# Altium project TIDA-010086_mod.PrjPcb (part 3 of 11)
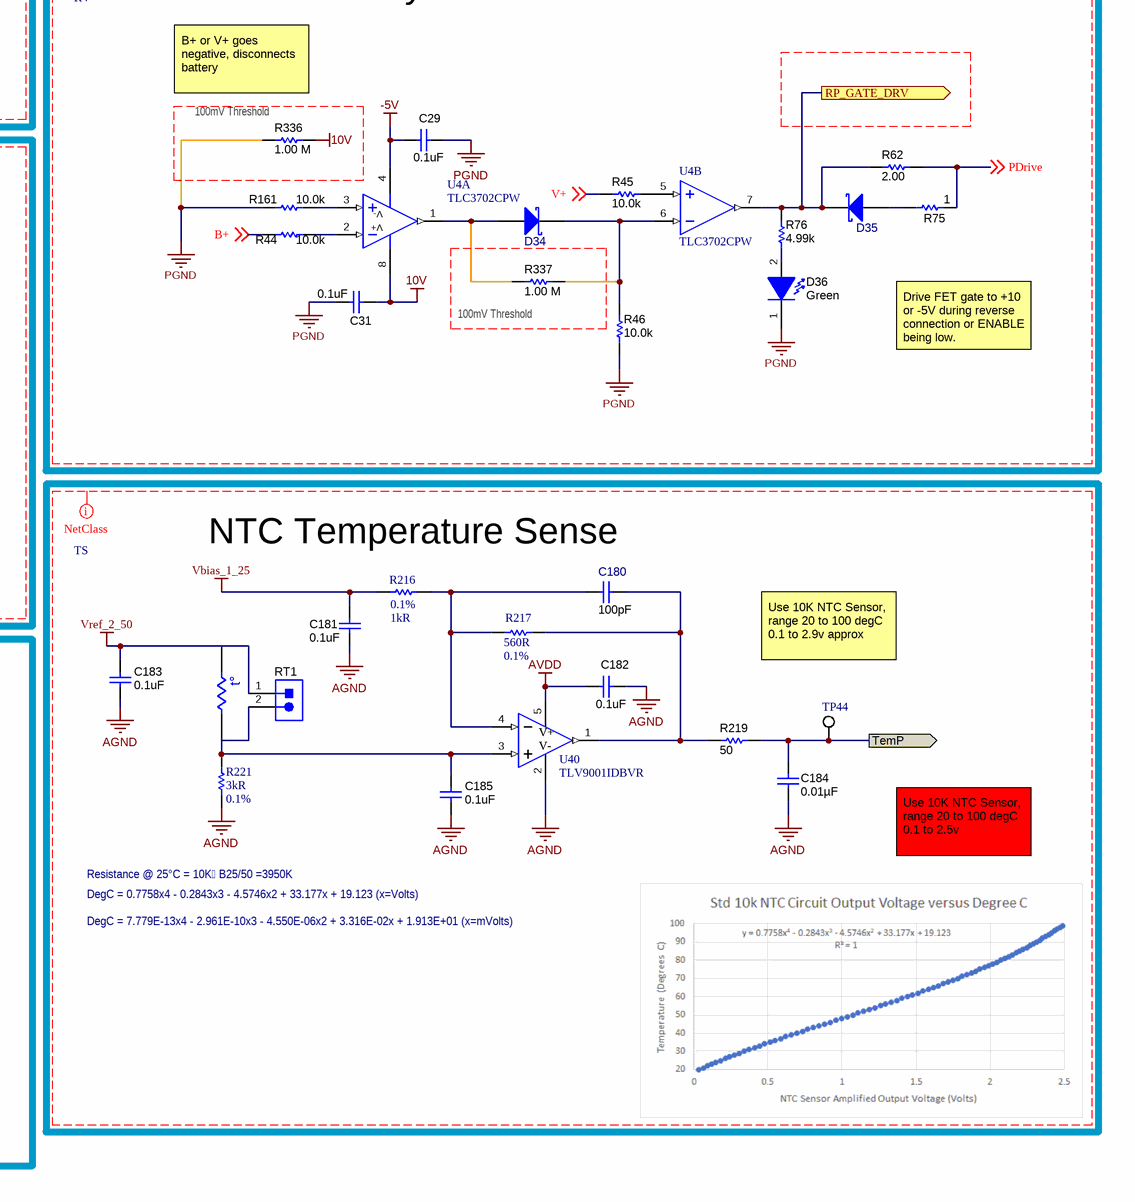
[diagram p20: XTIDA-010086_Power Stage.SchDoc, bottom right]

## Sheet XTIDA-010086_Power Stage.SchDoc: Power Stage (continued)

### Notes on the sheet
- FUSE BROKEN DETECT
- RC snubber
- (near R10) DNP
- RP Disconnect
- (near C16) DNP
- (near R31) 32 0402
- (near R34) SAR ADC Buffer
  OCP and UCP via Comparators
  PeakCurrent Control
  400 kHz 1st order
  Peak, OCP, UCP, Trip
  0.4uS group delay
- 4.02k 0402
- (near C147) 100p 0402
- (near C17) 240p 0603
- (near C33) 11n 0402
- (near C33) 3.32kHz 4th order Bessel CCM CC Control
  samples 33.2kHz
- (near C35) 26.1n 0805
- (near R30) 2k4
- Keep R36 , R40 and C28 near ADS131M08
- 1.74k 0402
- (near C26) 2k 0402
- (near U2) -5V
- (near C27) 10n 0402
- (near C26) 10n 0402
- (near C18) Gain=1+50k/Rg
  =20.8333
  ads131 - FSR=1.2/Gain/5mOhm=11.52A
  c2000 - FSR = 1.25/Gain/5mOhm = 12A
- (near R336) B+ or V+ goes negative, disconnects battery
- (near R336) 100mV Threshold
- 14kHz 4-th Order Filter
  startup CV control
  wide filter, use digital filterings
  sample at 100kHz
- Keep R and C near C2000 Analog Pin
- (near R337) 100mV Threshold
- Drive FET gate to +10 or -5V during reverse connection or ENABLE being low.
- Gain=49.9/100=0.499
  ADC range: 5*0.499=2.495V
- Use 10K NTC Sensor, range 20 to 100 degC 0.1 to 2.9v approx
- 16kHz 4-th Order Filter
  AvgVoltage Control
  VacMeasure
  VdcMeasure
- Keep R68 , R74 and C51 near ADS131M08
- Resistance @ 25°C = 10K B25/50 =3950K
- Use 10K NTC Sensor, range 20 to 100 degC 0.1 to 2.5v
- 10n
- (near U6) -5V
- (near R302) 1.74k
- (near R71) 2k
- DegC = 0.7758x4 - 0.2843x3 - 4.5746x2 + 33.177x + 19.123 (x=Volts)
- DegC = 7.779E-13x4 - 2.961E-10x3 - 4.550E-06x2 + 3.316E-02x + 1.913E+01 (x=mVolts)
- (near C151) 11n
- (near C178) 26.1n
- Gain=32/131.8=0.24279
  4.9425v = 1.2v
  ADC Range+- 4.9425v
- Drawn By:
- SVN Rev:
- Number:
- TID #:
- Orderable:
- Rev:
- Sheet Title:
- File:
- Project Title:
- Designed for:
- Assembly Variant:
- Mod. Date:
- Sheet:
- Size:
- of
- C
- http://www.ti.com
- Texas Instruments and/or its licensors do not warrant the accuracy or completeness of this specification or any information contained therein. Texas Instruments and/or its licensors do not warrant that this design will meet the specifications, will be suitable for your application or fit for any particular purpose, or will operate in an implementation. Texas Instruments and/or its licensors do not warrant that the design is production worthy. You should completely validate and test your design implementation to confirm the system functionality for your application.
- Engineer:
- Contact:
- © Texas Instruments
- (in symbol CSD16570Q5B) 7,8; 1,2,3; 5,6,
- (in symbol MOSFET_N_D56789G4S123) 5,6,; 7,8; 1,2,3
- (in symbol Opamp_Dual, part A) A
- (in symbol Opamp_Dual, part B) B
- (in symbol Res Thermal) t°
- (in symbol TLC3702CPW, part A) V-; V+